# Altium project Lucido.PrjPcb
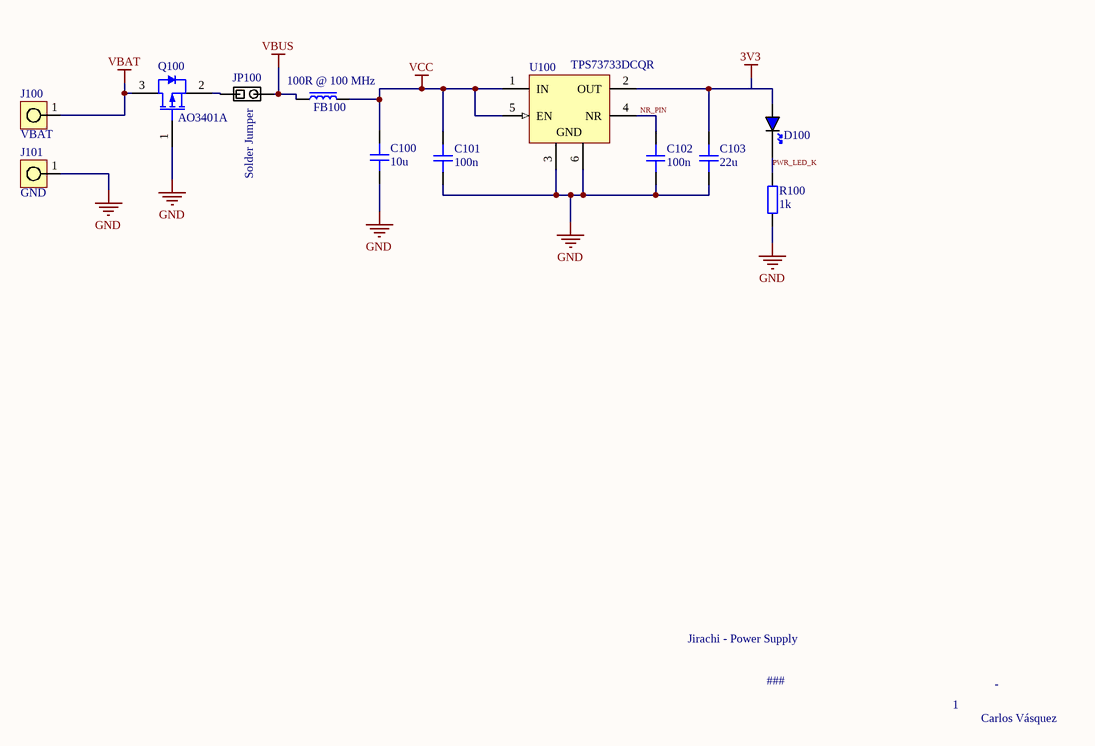
[diagram p0: Power.SchDoc]
4 sheets, 70 parts. Net scope: global (net labels, ports and power ports of the same name join across sheets).
Board file: Lucido.PcbDoc
Sheets:
  Power.SchDoc
  MCU.SchDoc
  Sensors.SchDoc
  Drivers.SchDoc

## Sheet Power.SchDoc
size Letter; SheetNumber: 1; SheetTotal: 4

### Parts
C100  10u  [CAP_0805]
C101  100n  [CAP_0603]
C102  100n  [CAP_0603]
C103  22u  [CAP_0603]
D100  BLUE  [LED_0805_BLUE]  (value not drawn)
FB100  100R @ 100 MHz  [FB_0805]
J100  VBAT  [SOLDER_PIN_THT_1_5]
J101  GND  [SOLDER_PIN_THT_1_5]
JP100  Solder Jumper  [SolderJumper_Single]
Q100  AO3401A  [AO-SOT-23-3L_V]
R100  1k  [RES_0402]
U100  TPS73733DCQR  [DCQ0006A_N]

### Nets
3V3: C103.2 D100.A U100.2(OUT)
GND: C100.1 C101.1 C102.1 C103.1 J101.1 Q100.1(GATE) R100.1 U100.3(GND) U100.6(GND)
VBAT: J100.1 Q100.3(DRAIN)
VBUS: FB100.1 JP100.2
VCC: C100.2 C101.2 FB100.2 U100.1(IN) U100.5(EN)
NR_PIN: C102.2 U100.4(NR)
PWR_LED_K: D100.K R100.2
NetJP100_1: JP100.1 Q100.2(SOURCE)

### Notes on the sheet
- Jirachi - Power Supply
- ###
- 1
- -
- Carlos Vásquez

### Library data of the parts
C100 = CAP_0805: Capacitor SMD 0805; Manufacturer: *; Manufacturer Part Number: *; Distributor Link: *; LCSC: *; Rating: *; Dielectric: *
C101-C103 = CAP_0603: Capacitor SMD 0603; Manufacturer: *; Manufacturer Part Number: *; Distributor Link: *; LCSC: *; Rating: *; Dielectric: *
D100 = LED_0805_BLUE: LED 0805 BLUE SMD; Manufacturer: *; Manufacturer Part Number: *; Distributor Link: *; LCSC: *
FB100 = FB_0805: Ferrite Bead SMD 0805; Manufacturer: *; Manufacturer Part Number: *; Distributor Link: *; LCSC: *
J100 J101 = SOLDER_PIN_THT: Solder Pin 1.5mm Through-Hole
JP100 = SolderJumper_Single: Solder Jumper Single 0.5mm Pitch
Q100 = CMP-2000-05778-1: P-Channel MOSFET, 30 V, 4 A, -55 to 150 degC, 3-Pin SOT-23-3L, RoHS, Tape and Reel; Manufacturer: Alpha and Omega; Output Power (Max): NotRequiredW; Power Dissipation: 1.4W; Rad Hardened: No; Drain Efficiency: NotRequired%; Drain-Source On-Volt: 30V; Noise Figure: NotRequireddB; Frequency (Max): NotRequiredMHz; Number of  Elements: 1; Gate-Source Voltage (Max): ?12V; Drain Current (Max): 4A; Channel Mode: Enhancement; Drain-Source On-Res: 0.044ohm; Type: PowerMOSFET; Polarity: P; Package URL: http://www.aosmd.com/res/packaging_information/SOT-23-3L.pdf; Datasheet URL: http://www.aosmd.com/res/data_sheets/AO3401A.pdf; Package Type: SOT-23; Package Description: 3-Pin Small Outline Transistor, Body 2.95 x 1.6 mm, Pitch 0.95 mm; Mounting: SurfaceMount; Manufacturer URL: http://www.aosmd.com/; Continuous Drain Current: 4A; Package Reference: SOT-23-3L; Mounting Technology: SurfaceMount; Operating Temperature Classification: Military; Power Gain: NotRequireddB; Datasheet Version: Rev. 3, 03/2011; Operating Temp Range: -55Cto150C; Pin Count: 3
R100 = RES_0402: Resistor SMD 0402; Manufacturer: *; Manufacturer Part Number: *; Distributor Link: *; LCSC: *
U100 = CMP-0395-00300-2: Single Output LDO, 1 A, Fixed 3.3 V Output, 2.2 to 5.5 V Input, with Reverse Current Protection, 6-pin SOT-223 (DCQ), -40 to 125 degC, Green (RoHS & no Sb/Br); Manufacturer: Texas Instruments; Fixed Output Options(V): 3.3; Vdo(Typ)(mV): 130; Iout(Max)(A): 1; Accuracy(%): 3; SubFamily: Single Channel LDO; Vin(Min)(V): 2.2; Vin(Max)(V): 5.5; Rating: Catalog; Iq(Typ)(mA): 0.3; PartNumber: TPS73733DCQR; DatasheetVersion: SBVS067O; PackageReference: DCQ0006A; ComponentLink3URL: http://www.ti.com/litv/pdf/mpds098c; ComponentLink2Description: Datasheet; PackageDescription: 6-Pin Plastic Small Outline, Body 3.5 x 6.5 mm, Pitch 1.27 mm; ComponentLink2URL: http://www.ti.com/general/docs/lit/getliterature.tsp?genericPartNumber=TPS73733&fileType=pdf; PackageVersion: 4202109/D; Vout Adj(Min)(V): 3.3; Vout Adj(Max)(V): 3.3; Eco-Plan: Green (RoHS & no Sb/Br); ComponentLink3Description: Package Specification; Mounting Technology: Surface Mount; ComponentLink1URL: http://www.ti.com/; ComponentLink1Description: Manufacturer URL

## Sheet MCU.SchDoc
size Letter; SheetNumber: 2; SheetTotal: 4
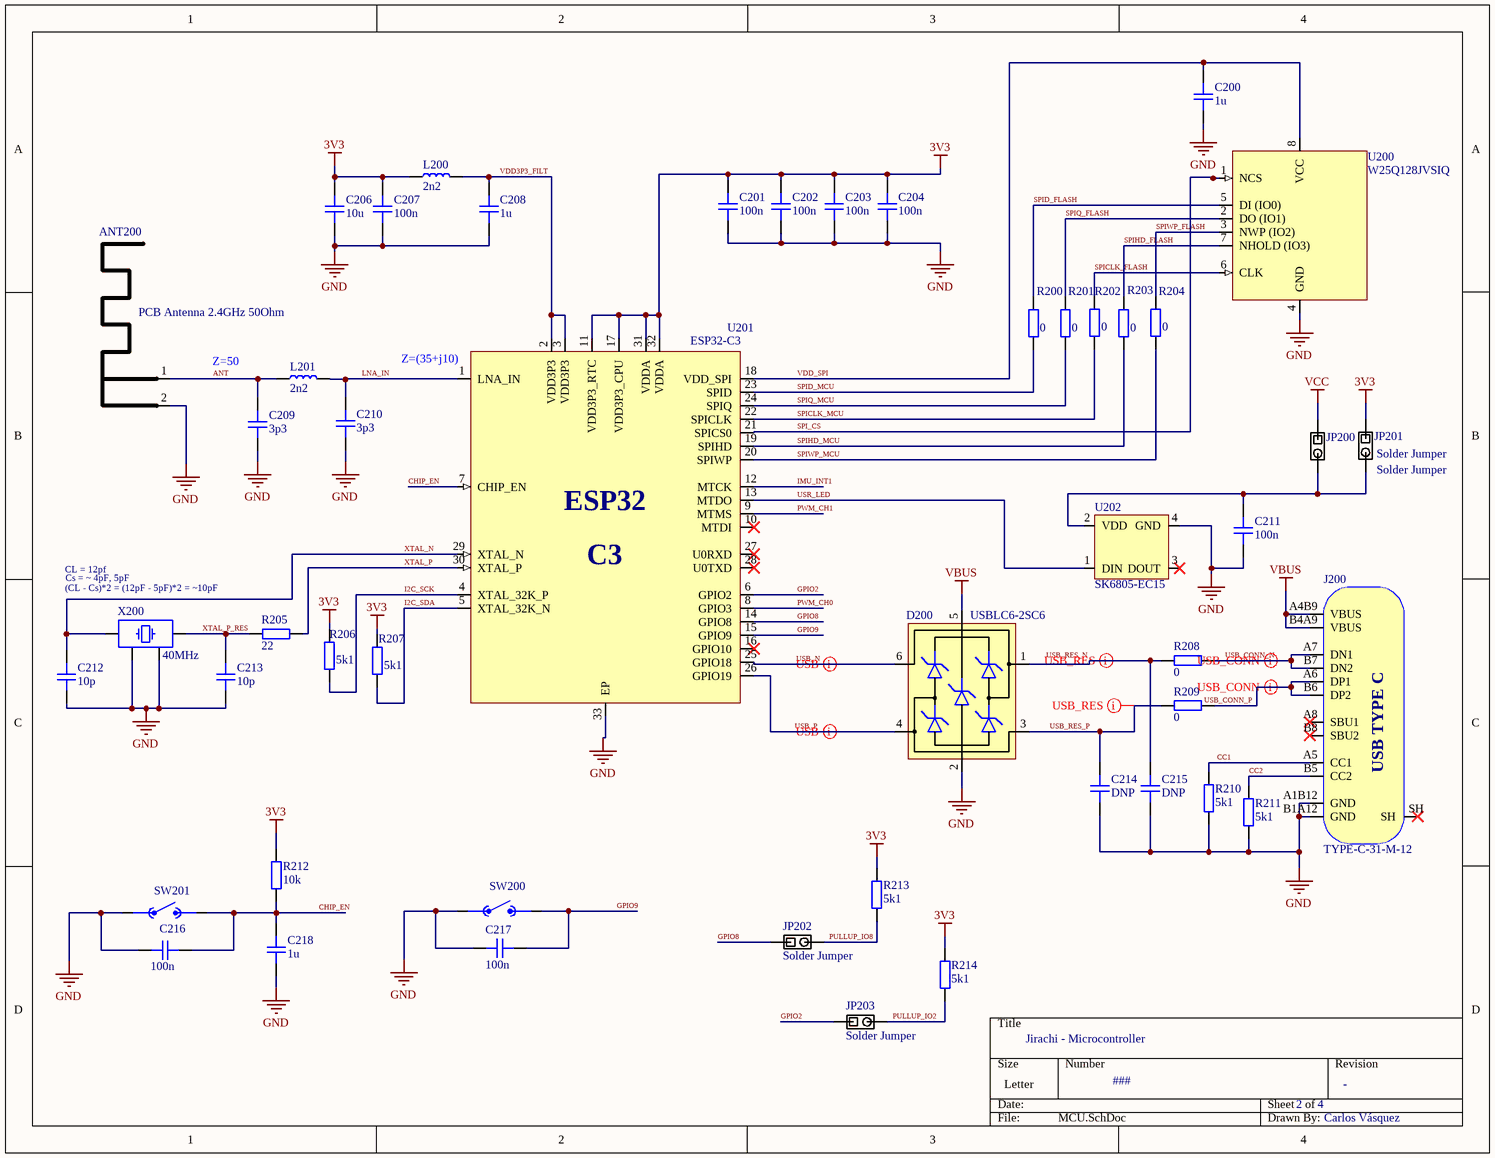
[diagram p1: MCU.SchDoc]

### Parts
ANT200  PCB Antenna 2.4GHz 50Ohm  [ANT_IFA_USB_2_4GHZ_50R]  (no BOM)
C200  1u  [CAP_0402]
C201  100n  [CAP_0402]
C202  100n  [CAP_0402]
C203  100n  [CAP_0402]
C204  100n  [CAP_0402]
C206  10u  [CAP_0603]
C207  100n  [CAP_0402]
C208  1u  [CAP_0402]
C209  3p3  [CAP_0402]
C210  3p3  [CAP_0402]
C211  100n  [CAP_0402]
C212  10p  [CAP_0402]
C213  10p  [CAP_0402]
C214  DNP  [CAP_0603]
C215  DNP  [CAP_0603]
C216  100n  [CAP_0402]
C217  100n  [CAP_0402]
C218  1u  [CAP_0402]
D200  USBLC6-2SC6  [SOT-23-6]
J200  TYPE-C-31-M-12  [TYPE-C-31-M-12]
JP200  Solder Jumper  [SolderJumper_Single]
JP201  Solder Jumper  [SolderJumper_Single]
JP202  Solder Jumper  [SolderJumper_Single]
JP203  Solder Jumper  [SolderJumper_Single]
L200  2n2  [IND_0402]
L201  2n2  [IND_0402]
R200  0  [RES_0402]
R201  0  [RES_0402]
R202  0  [RES_0402]
R203  0  [RES_0402]
R204  0  [RES_0402]
R205  22  [RES_0402]
R206  5k1  [RES_0402]
R207  5k1  [RES_0402]
R208  0  [RES_0402]
R209  0  [RES_0402]
R210  5k1  [RES_0402]
R211  5k1  [RES_0402]
R212  10k  [RES_0402]
R213  5k1  [RES_0402]
R214  5k1  [RES_0402]
SW200  SW SPST SMD Terreneitor  [SW SPST SMD Terreneitor]  (value not drawn)
SW201  SW SPST SMD Terreneitor  [SW SPST SMD Terreneitor]  (value not drawn)
U200  W25Q128JVSIQ  [SOIC8_208 mil]
U201  ESP32-C3  [QFN32-5x5]
U202  SK6805-EC15  [SK6805-EC15]
X200  40MHz  [XTAL_3225]

### Nets
3V3: C201.1 C202.1 C203.1 C204.1 C206.1 C207.1 JP201.1 L200.1 R206.2 R207.2 R212.2 R213.2 R214.2 U201.11(VDD3P3_RTC) U201.17(VDD3P3_CPU) U201.31(VDDA) U201.32(VDDA)
GND: ANT200.2(GND) C200.1 C201.2 C202.2 C203.2 C204.2 C206.2 C207.2 C208.1 C209.1 C210.1 C211.1 C212.2 C213.2 C214.1 C215.1 C216.2 C217.2 C218.1 D200.2(GND) J200.A1B12(GND) J200.B1A12(GND) R210.1 R211.1 SW200.1 SW201.1 U200.4(GND) U201.33(EP) U202.4(GND) X200.2 X200.4
VBUS: D200.5(VBUS) J200.A4B9(VBUS) J200.B4A9(VBUS)
VCC: JP200.1
ANT: ANT200.1(RF) C209.2 L201.1
CC1: J200.A5(CC1) R210.2
CC2: J200.B5(CC2) R211.2
CHIP_EN: C216.1 C218.2 R212.1 SW201.2 U201.7(CHIP_EN)
GPIO2: JP203.1 U201.6(GPIO2)
GPIO8: JP202.1 U201.14(GPIO8)
GPIO9: C217.1 SW200.2 U201.15(GPIO9)
I2C_SCK: R206.1 U201.4(XTAL_32K_P)
I2C_SDA: R207.1 U201.5(XTAL_32K_N)
IMU_INT1: U201.12(MTCK)
LNA_IN: C210.2 L201.2 U201.1(LNA_IN)
PULLUP_IO2: JP203.2 R214.1
PULLUP_IO8: JP202.2 R213.1
PWM_CH0: U201.8(GPIO3)
PWM_CH1: U201.9(MTMS)
SPI_CS: U200.1(NCS) U201.21(SPICS0)
SPICLK_FLASH: R202.2 U200.6(CLK)
SPICLK_MCU: R202.1 U201.22(SPICLK)
SPID_FLASH: R200.2 U200.5(DI_(IO0))
SPID_MCU: R200.1 U201.23(SPID)
SPIHD_FLASH: R203.2 U200.7(NHOLD_(IO3))
SPIHD_MCU: R203.1 U201.19(SPIHD)
SPIQ_FLASH: R201.2 U200.2(DO_(IO1))
SPIQ_MCU: R201.1 U201.24(SPIQ)
SPIWP_FLASH: R204.2 U200.3(NWP_(IO2))
SPIWP_MCU: R204.1 U201.20(SPIWP)
USB_CONN_N: J200.A7(DN1) J200.B7(DN2) R208.2
USB_CONN_P: J200.A6(DP1) J200.B6(DP2) R209.2
USB_N: D200.6(IO1) U201.25(GPIO18)
USB_P: D200.4(IO2) U201.26(GPIO19)
USB_RES_N: C215.2 D200.1(IO1) R208.1
USB_RES_P: C214.2 D200.3(IO2) R209.1
USR_LED: U201.13(MTDO) U202.1(DIN)
VDD3P3_FILT: C208.2 L200.2 U201.2(VDD3P3) U201.3(VDD3P3)
VDD_SPI: C200.2 U200.8(VCC) U201.18(VDD_SPI)
XTAL_N: C212.1 U201.29(XTAL_N) X200.1
XTAL_P: R205.2 U201.30(XTAL_P)
XTAL_P_RES: C213.1 R205.1 X200.3
NetC211_2: C211.2 JP200.2 JP201.2 U202.2(VDD)

Not connected (* = marked no-connect by the designer): J200 A8(SBU1)* B8(SBU2)* SH*; U201 10(MTDI)* 16(GPIO10)* 27(U0RXD)* 28(U0TXD)*; U202 3(DOUT)*

### Layout directives
differential pair: USB_CONN_N, USB_CONN_P, USB_N, USB_P, USB_RES_N, USB_RES_P

### Notes on the sheet
- Z=50
- (near U201) Z=(35+j10)
- CL = 12pf
- (CL - Cs)*2 = (12pF - 5pF)*2 = ~10pF
- (near X200) Cs = ~ 4pF, 5pF
- Jirachi - Microcontroller
- ###
- 2
- -
- Carlos Vásquez
- (in symbol ESP32-C3) ESP32; C3
- (in symbol TYPE-C-31-M-12) USB TYPE C

### Library data of the parts
ANT200 = ANT_IFA_USB_2_4GHZ_50R: Inverted F 2.4GHz ISM PCB Antenna 50 Ohm; ComponentLink1Description: Datasheet; ComponentLink1URL: https://www.ti.com/lit/an/swra117d/swra117d.pdf
C200-C204 C207-C213 C216-C218 = CAP_0402: Capacitor SMD 0402; Manufacturer: *; Manufacturer Part Number: *; Distributor Link: *; LCSC: *; Rating: *; Dielectric: *
C206 C214 C215 = CAP_0603: Capacitor SMD 0603; Manufacturer: *; Manufacturer Part Number: *; Distributor Link: *; LCSC: *; Rating: *; Dielectric: *
D200 = USBLC6-2SC6: Low-Capacitance ESD Protection USB; Manufacturer: STMicroelectronics; Manufacturer Part Number: USBLC6-2SC6; Distributor Link: https://www.mouser.de/ProductDetail/STMicroelectronics/USBLC6-2SC6?qs=po45yt2pPpu%2FhNIlwQdTlg%3D%3D
J200 = TYPE-C-31-M-12: USB Type C Connector Horizontal SMT; Manufacturer: Koren Hroparts; Manufacturer Part Number: TYPE-C-31-M-12
JP200-JP203 = SolderJumper_Single: Solder Jumper Single 0.5mm Pitch
L200 L201 = IND_0402: Inductor SMD 0402
R200-R214 = RES_0402: Resistor SMD 0402; Manufacturer: *; Manufacturer Part Number: *; Distributor Link: *; LCSC: *
SW200 SW201 = SW SPST SMD Terreneitor: SPST SW TS-1187A-B-A-B
U200 = W25Q128JVSIQ: 128M-BIT / SERIAL FLASH MEMORY WITH / DUAL/QUAD SPI & QPI & DTR SOIC-8 208 MIL; Manufacturer: Winbond; Manufacturer Part Number: W25Q128JVSIM
U201 = ESP32-C3: Ultra­Low­Power SoC with RISC­V Single­Core CPU Supporting IEEE 802.11b/g/n (2.4 GHz Wi­Fi) and Bluetooth® 5 (LE); Manufacturer: Espressif; Manufacturer Part Number: ESP32-C3; LCSC: C2838500
X200 = TSX-3225_24.0000MF15X-AC: Crystal SMD 40MHz 10PPM 12pF 3225; Manufacturer: Epson; Manufacturer Part Number: TSX-3225 24.0000MF15X-AC

## Sheet Sensors.SchDoc
size Letter; SheetNumber: 3; SheetTotal: 4
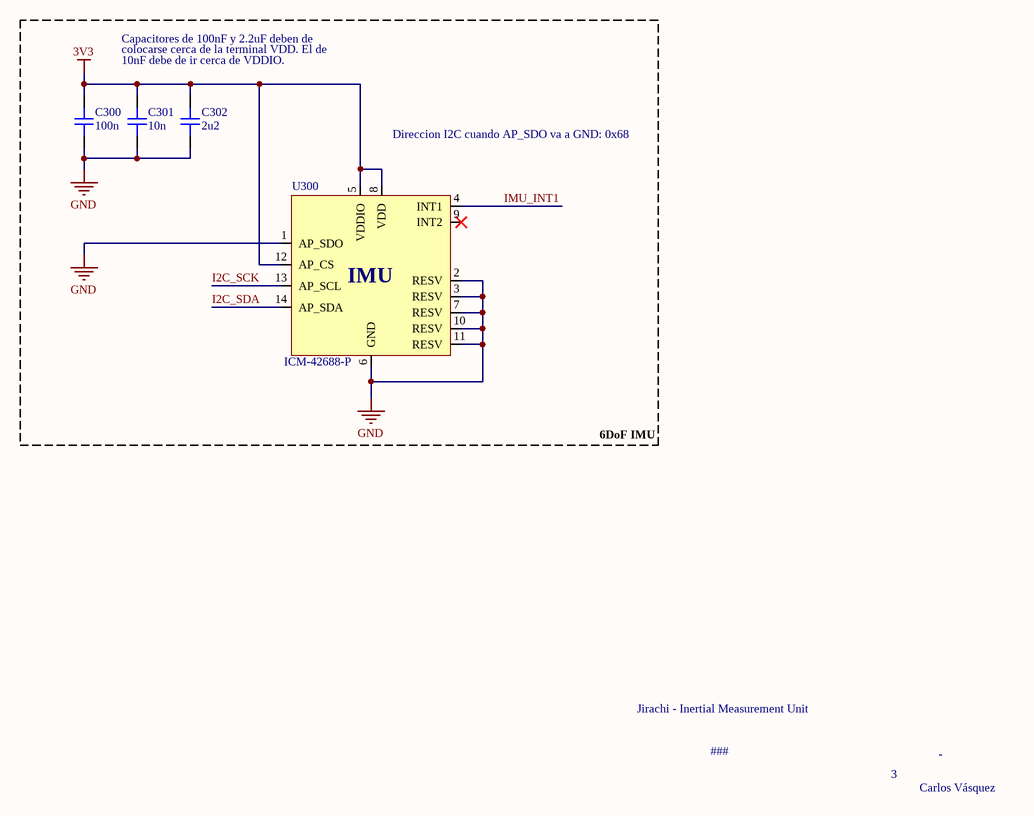
[diagram p2: Sensors.SchDoc]

### Parts
C300  100n  [CAP_0402]
C301  10n  [CAP_0402]
C302  2u2  [CAP_0402]
U300  ICM-42688-P  [LGA14 (2.5mm x 3mm)]

### Nets
3V3: C300.2 C301.2 C302.2 U300.5(VDDIO) U300.8(VDD) U300.12(AP_CS)
GND: C300.1 C301.1 C302.1 U300.1(AP_SDO) U300.2(RESV) U300.3(RESV) U300.6(GND) U300.7(RESV) U300.10(RESV) U300.11(RESV)
I2C_SCK: U300.13(AP_SCL)
I2C_SDA: U300.14(AP_SDA)
IMU_INT1: U300.4(INT1)

Not connected (* = marked no-connect by the designer): U300 9(INT2)*

### Notes on the sheet
- Capacitores de 100nF y 2.2uF deben de
- colocarse cerca de la terminal VDD. El de
- 10nF debe de ir cerca de VDDIO.
- (near U300) Direccion I2C cuando AP_SDO va a GND: 0x68
- 6DoF IMU
- Jirachi - Inertial Measurement Unit
- ###
- 3
- -
- Carlos Vásquez
- (in symbol ICM-42688-P) IMU

### Library data of the parts
C300-C302 = CAP_0402: Capacitor SMD 0402; Manufacturer: *; Manufacturer Part Number: *; Distributor Link: *; LCSC: *; Rating: *; Dielectric: *
U300 = ICM-42688-P: 6-axis MEMS IMU (Accelerometer & Gyroscope)

## Sheet Drivers.SchDoc
size Letter; SheetNumber: 4; SheetTotal: 4
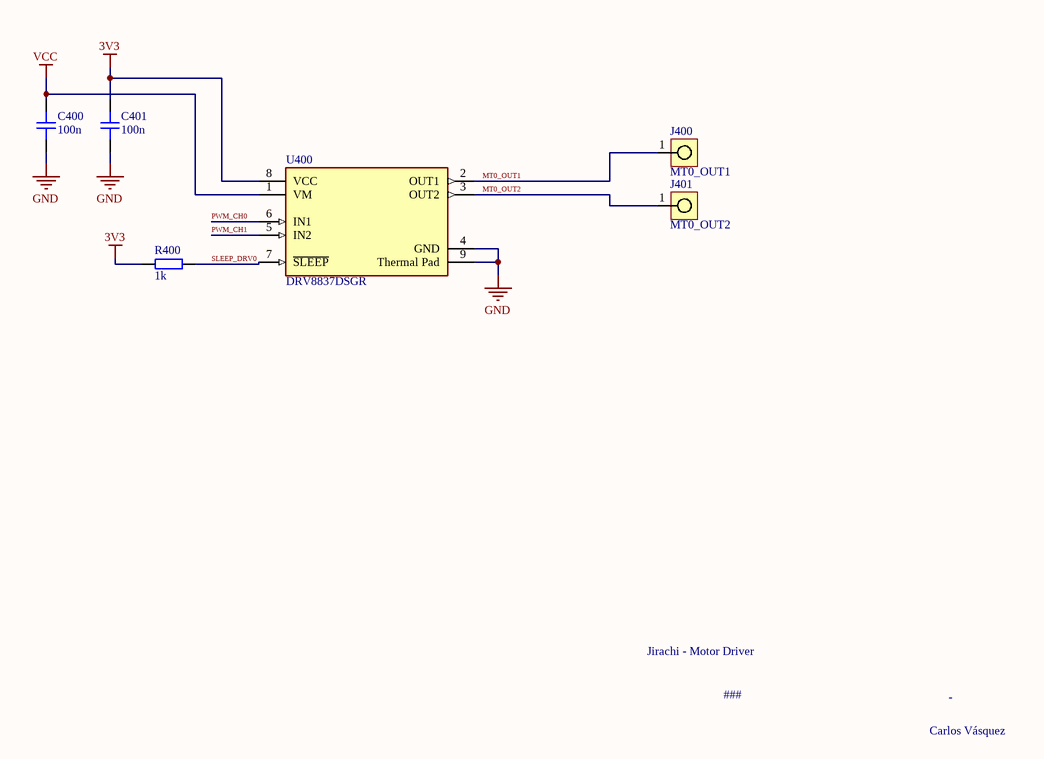
[diagram p3: Drivers.SchDoc]

### Parts
C400  100n  [CAP_0402]
C401  100n  [CAP_0402]
J400  MT0_OUT1  [SOLDER_PIN_THT_1_5]
J401  MT0_OUT2  [SOLDER_PIN_THT_1_5]
R400  1k  [RES_0402]
U400  DRV8837DSGR  [FP-DSG0008A-MFG]

### Nets
3V3: C401.2 R400.2 U400.8(VCC)
GND: C400.1 C401.1 U400.4(GND) U400.9(Thermal_Pad)
VCC: C400.2 U400.1(VM)
MT0_OUT1: J400.1 U400.2(OUT1)
MT0_OUT2: J401.1 U400.3(OUT2)
PWM_CH0: U400.6(IN1)
PWM_CH1: U400.5(IN2)
SLEEP_DRV0: R400.1 U400.7(~{SLEEP})

### Notes on the sheet
- Jirachi - Motor Driver
- ###
- -
- Carlos Vásquez

### Library data of the parts
C400 C401 = CAP_0402: Capacitor SMD 0402; Manufacturer: *; Manufacturer Part Number: *; Distributor Link: *; LCSC: *; Rating: *; Dielectric: *
J400 J401 = SOLDER_PIN_THT: Solder Pin 1.5mm Through-Hole
R400 = RES_0402: Resistor SMD 0402; Manufacturer: *; Manufacturer Part Number: *; Distributor Link: *; LCSC: *
U400 = CMP-04915-000004-1: IC MOTOR DRIVER PAR 8WSON; Manufacturer: Texas Instruments; Switching Frequency: 0-250kHz; Min Supply Voltage: 1.8V; Standoff Height: 0mm; Max Supply Voltage: 7V; Output Voltage: 0-11V; Motor Type: Brushed; Number Of Outputs: 2; Output Current: 1.8A; Max Junction Temp: +150°C; Nominal Supply Current: 300-700uA; Mouser Description: Motor / Motion / Ignition Controllers & Drivers 1.8A Low Vltg Brush DC Motor Driver; Device Class L2: Power Management ICs; Manufacturer Part Number: DRV8837DSGR; Temperature Range Low: -40°C; Lead Free: Yes; Height: 0.8mm; Device Class L3: Motor Drivers; Octopart: https://octopart.com/drv8837dsgr-texas+instruments-23786726; Package: DSG0008A; ComponentLink2URL: http://www.ti.com/lit/ds/symlink/drv8837.pdf; Temperature: -40°C to +85°C; Ambient Temperature Range Low: -40°C; ComponentLink2Description: Datasheet; Ambient Temperature Range High: +85°C; Device Class L1: Integrated Circuits (ICs); Category: IC; Temperature Range High: +85°C; RoHS: TRUE; Automotive: No; Digikey Description: IC MOTOR DRIVER PAR 8WSON

## Nets that join several sheets
3V3: Power (C103.2 D100.A U100.2), MCU (17 pins), Sensors (6 pins), Drivers (C401.2 R400.2 U400.8)
GND: Power (9 pins), MCU (31 pins), Sensors (10 pins), Drivers (C400.1 C401.1 U400.4 U400.9)
VBUS: Power (FB100.1 JP100.2), MCU (D200.5 J200.A4B9 J200.B4A9)
VCC: Power (5 pins), MCU (JP200.1), Drivers (C400.2 U400.1)
I2C_SCK: MCU (R206.1 U201.4), Sensors (U300.13)
I2C_SDA: MCU (R207.1 U201.5), Sensors (U300.14)
IMU_INT1: MCU (U201.12), Sensors (U300.4)
PWM_CH0: MCU (U201.8), Drivers (U400.6)
PWM_CH1: MCU (U201.9), Drivers (U400.5)